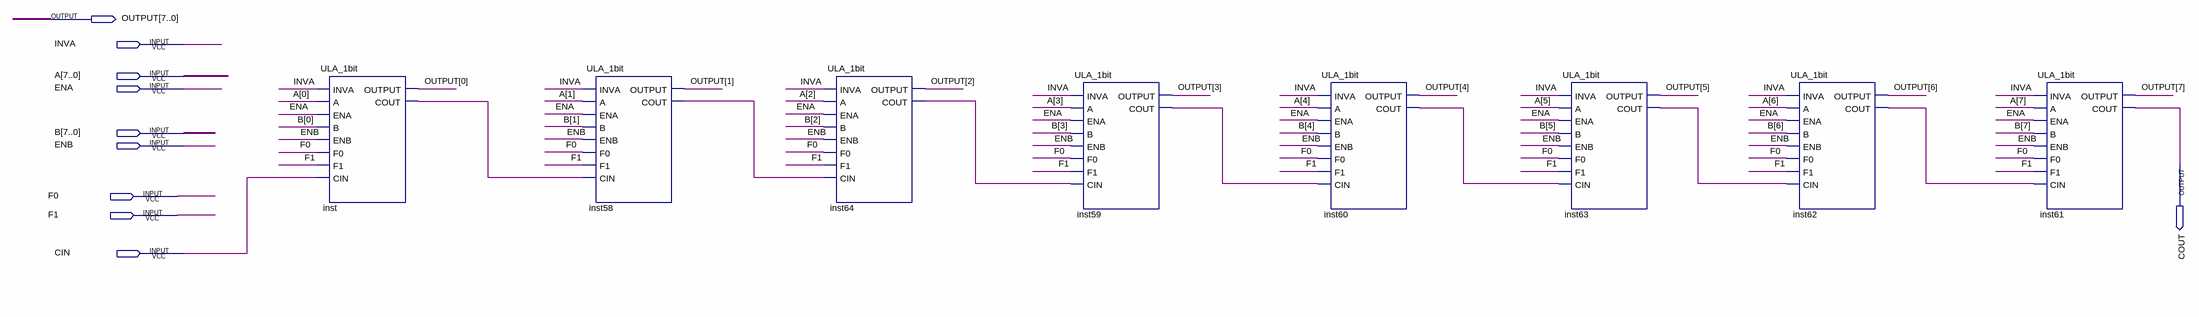
[diagram p0: schematic sheet]
// Quartus schematic ULA_8bits.bdf as structural Verilog: 8 symbols, 10 pins
module ULA_8bits (
  input  INVA,
  input  [7:0] A,
  input  ENA,
  input  [7:0] B,
  input  ENB,
  input  F0,
  input  F1,
  input  CIN,
  output [7:0] OUTPUT,
  output COUT
);

  wire inst58_cout, inst59_cout, inst60_cout, inst62_cout, inst63_cout, inst64_cout, inst_cout;

  ULA_1bit inst (
    .INVA(INVA), .A(A[0]), .ENA(ENA), .B(B[0]), .ENB(ENB), .F0(F0), .F1(F1), .CIN(CIN), .OUTPUT(OUTPUT[0]),
    .COUT(inst_cout));
  ULA_1bit inst58 (
    .INVA(INVA), .A(A[1]), .ENA(ENA), .B(B[1]), .ENB(ENB), .F0(F0), .F1(F1), .CIN(inst_cout),
    .OUTPUT(OUTPUT[1]), .COUT(inst58_cout));
  ULA_1bit inst64 (
    .INVA(INVA), .A(A[2]), .ENA(ENA), .B(B[2]), .ENB(ENB), .F0(F0), .F1(F1), .CIN(inst58_cout),
    .OUTPUT(OUTPUT[2]), .COUT(inst64_cout));
  ULA_1bit inst59 (
    .INVA(INVA), .A(A[3]), .ENA(ENA), .B(B[3]), .ENB(ENB), .F0(F0), .F1(F1), .CIN(inst64_cout),
    .OUTPUT(OUTPUT[3]), .COUT(inst59_cout));
  ULA_1bit inst60 (
    .INVA(INVA), .A(A[4]), .ENA(ENA), .B(B[4]), .ENB(ENB), .F0(F0), .F1(F1), .CIN(inst59_cout),
    .OUTPUT(OUTPUT[4]), .COUT(inst60_cout));
  ULA_1bit inst63 (
    .INVA(INVA), .A(A[5]), .ENA(ENA), .B(B[5]), .ENB(ENB), .F0(F0), .F1(F1), .CIN(inst60_cout),
    .OUTPUT(OUTPUT[5]), .COUT(inst63_cout));
  ULA_1bit inst62 (
    .INVA(INVA), .A(A[6]), .ENA(ENA), .B(B[6]), .ENB(ENB), .F0(F0), .F1(F1), .CIN(inst63_cout),
    .OUTPUT(OUTPUT[6]), .COUT(inst62_cout));
  ULA_1bit inst61 (
    .INVA(INVA), .A(A[7]), .ENA(ENA), .B(B[7]), .ENB(ENB), .F0(F0), .F1(F1), .CIN(inst62_cout),
    .OUTPUT(OUTPUT[7]), .COUT(COUT));
endmodule
